# Altium schematic sheet Overview.SchDoc: Port connections / overview
size A4; SheetNumber: 1; SheetTotal: 6
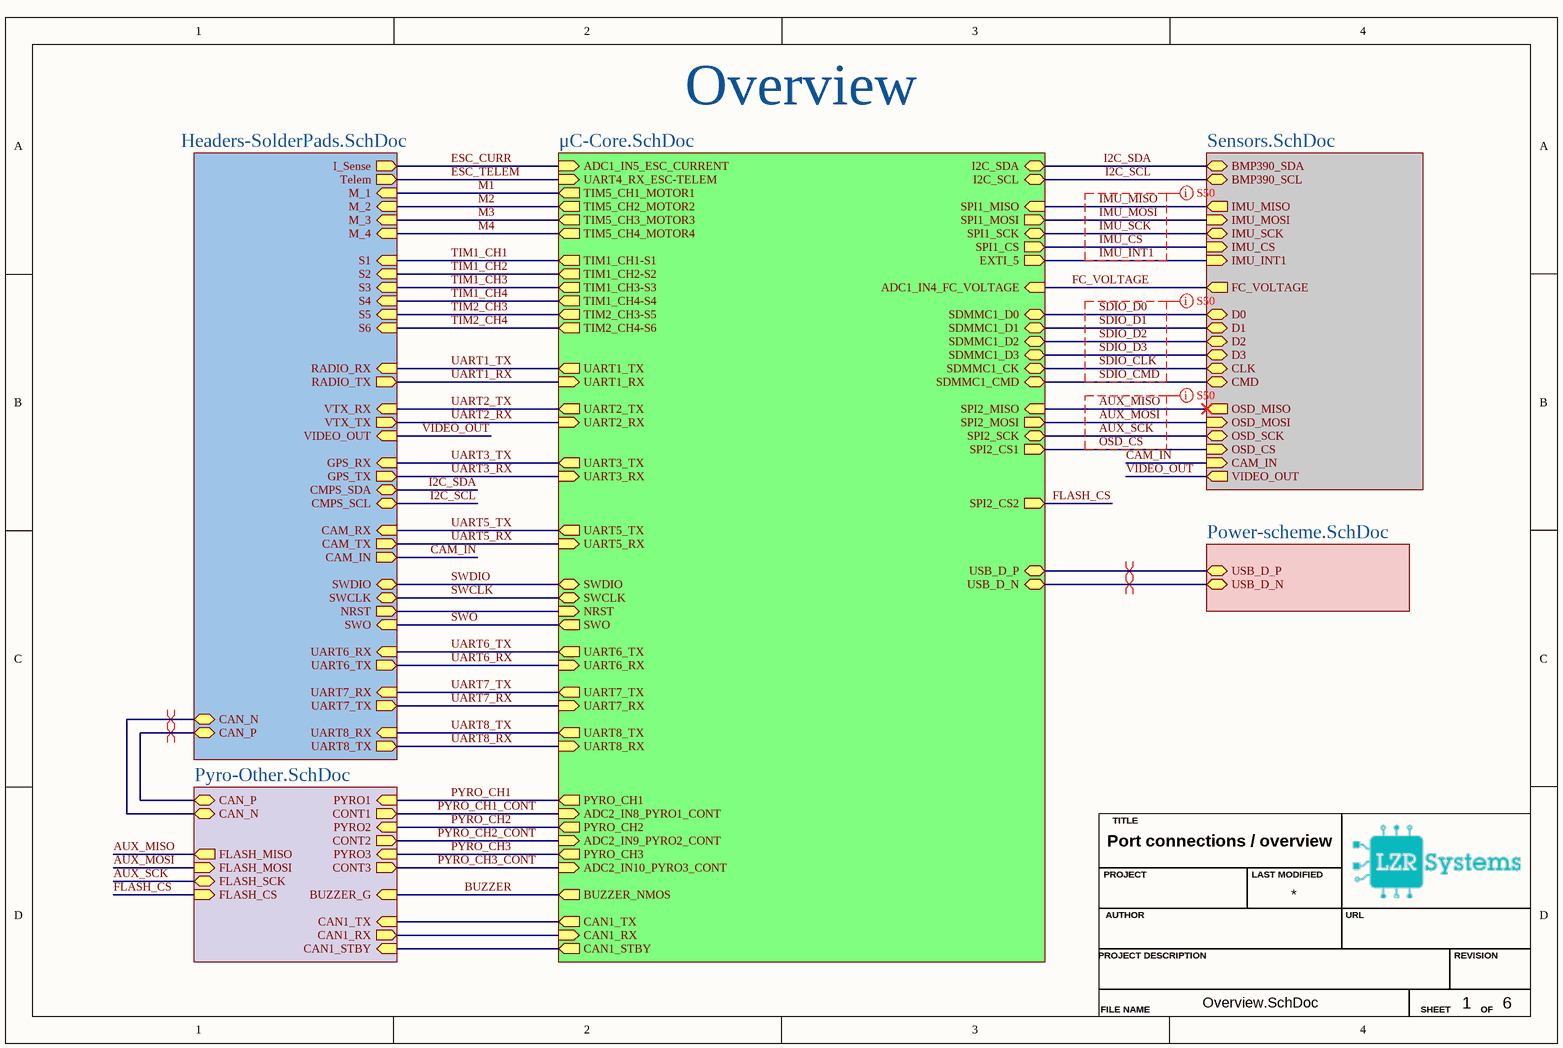
[diagram p0: Overview.SchDoc]

## Sub-sheets
U_Headers-SolderPads = Headers-SolderPads.SchDoc: I_Sense (out), M_2 (in), M_3 (in), M_4 (in), Telem (out), M_1 (in), S1 (in), S2 (in), S3 (in), S4 (in), S5 (in), S6 (in), GPS_TX (out), CMPS_SDA (bidir), CMPS_SCL (bidir), CAM_RX (in), CAM_TX (out), CAM_IN (out), SWDIO (bidir), SWCLK (bidir), SWO (in), GPS_RX (in), RADIO_TX (out), RADIO_RX (in), VTX_TX (out), VTX_RX (in), VIDEO_OUT (in), NRST (out), UART6_TX (out), UART6_RX (in), UART7_TX (out), UART7_RX (in), UART8_TX (out), UART8_RX (in), CAN_P (bidir), CAN_N (bidir)
U_Power-scheme = Power-scheme.SchDoc: USB_D_P (bidir), USB_D_N (bidir)
U_Pyro-Other = Pyro-Other.SchDoc: PYRO1 (in), CONT1 (out), PYRO2 (in), PYRO3 (in), CONT2 (out), CONT3 (out), BUZZER_G (in), CAN1_RX (out), CAN1_TX (in), CAN1_STBY (in), CAN_P (bidir), CAN_N (bidir), FLASH_MISO (out), FLASH_MOSI (in), FLASH_SCK (bidir), FLASH_CS (in)
U_Sensors = Sensors.SchDoc: BMP390_SCL (bidir), BMP390_SDA (bidir), IMU_CS (in), IMU_INT1 (in), IMU_SCK (bidir), IMU_MISO (out), IMU_MOSI (in), FC_VOLTAGE (out), D3 (bidir), D2 (bidir), CMD (bidir), CLK (bidir), D0 (bidir), D1 (bidir), OSD_CS (in), OSD_MOSI (in), OSD_MISO (out), OSD_SCK (bidir), VIDEO_OUT (out), CAM_IN (in)
U_μC-Core = μC-Core.SchDoc: SWDIO (bidir), SWCLK (bidir), SWO (out), SPI1_CS (out), SPI1_SCK (bidir), SPI1_MISO (in), SPI1_MOSI (out), SPI2_SCK (bidir), SPI2_MOSI (out), SPI2_MISO (in), SDMMC1_CMD (bidir), SDMMC1_CK (bidir), SDMMC1_D3 (bidir), SDMMC1_D2 (bidir), SDMMC1_D1 (bidir), SDMMC1_D0 (bidir), PYRO_CH3 (out), PYRO_CH2 (out), PYRO_CH1 (out), ADC1_IN4_FC_VOLTAGE (in), ADC1_IN5_ESC_CURRENT (in), TIM5_CH1_MOTOR1 (out), TIM5_CH2_MOTOR2 (out), TIM5_CH3_MOTOR3 (out), TIM5_CH4_MOTOR4 (out), UART4_RX_ESC-TELEM (in), BUZZER_NMOS (out), USB_D_P (bidir), USB_D_N (bidir), UART1_TX (out), UART1_RX (in), UART2_TX (out), UART2_RX (in), UART3_TX (out), UART3_RX (in), UART5_TX (out), UART5_RX (in), UART6_TX (out), UART6_RX (in), UART7_TX (out), UART7_RX (in), UART8_TX (out), UART8_RX (in), TIM2_CH3-S5 (out), TIM2_CH4-S6 (out), TIM1_CH1-S1 (out), TIM1_CH2-S2 (out), TIM1_CH3-S3 (out), TIM1_CH4-S4 (out), I2C_SCL (bidir), I2C_SDA (bidir), EXTI_5 (out), NRST (in), ADC2_IN8_PYRO1_CONT (in), ADC2_IN9_PYRO2_CONT (in), ADC2_IN10_PYRO3_CONT (in), CAN1_STBY (out), CAN1_RX (in), CAN1_TX (out), SPI2_CS1 (out), SPI2_CS2 (out)

## Nets
AUX_MISO: sheet U_μC-Core/SPI2_MISO, sheet U_Sensors/OSD_MISO, sheet U_Pyro-Other/FLASH_MISO
AUX_MOSI: sheet U_μC-Core/SPI2_MOSI, sheet U_Sensors/OSD_MOSI, sheet U_Pyro-Other/FLASH_MOSI
AUX_SCK: sheet U_μC-Core/SPI2_SCK, sheet U_Sensors/OSD_SCK, sheet U_Pyro-Other/FLASH_SCK
BUZZER: sheet U_μC-Core/BUZZER_NMOS, sheet U_Pyro-Other/BUZZER_G
CAM_IN: sheet U_Headers-SolderPads/CAM_IN, sheet U_Sensors/CAM_IN
ESC_CURR: sheet U_μC-Core/ADC1_IN5_ESC_CURRENT, sheet U_Headers-SolderPads/I_Sense
ESC_TELEM: sheet U_μC-Core/UART4_RX_ESC-TELEM, sheet U_Headers-SolderPads/Telem
FC_VOLTAGE: sheet U_μC-Core/ADC1_IN4_FC_VOLTAGE, sheet U_Sensors/FC_VOLTAGE
FLASH_CS: sheet U_μC-Core/SPI2_CS2, sheet U_Pyro-Other/FLASH_CS
I2C_SCL: sheet U_μC-Core/I2C_SCL, sheet U_Headers-SolderPads/CMPS_SCL, sheet U_Sensors/BMP390_SCL
I2C_SDA: sheet U_μC-Core/I2C_SDA, sheet U_Headers-SolderPads/CMPS_SDA, sheet U_Sensors/BMP390_SDA
IMU_CS: sheet U_μC-Core/SPI1_CS, sheet U_Sensors/IMU_CS
IMU_INT1: sheet U_μC-Core/EXTI_5, sheet U_Sensors/IMU_INT1
IMU_MISO: sheet U_μC-Core/SPI1_MISO, sheet U_Sensors/IMU_MISO
IMU_MOSI: sheet U_μC-Core/SPI1_MOSI, sheet U_Sensors/IMU_MOSI
IMU_SCK: sheet U_μC-Core/SPI1_SCK, sheet U_Sensors/IMU_SCK
M1: sheet U_μC-Core/TIM5_CH1_MOTOR1, sheet U_Headers-SolderPads/M_1
M2: sheet U_μC-Core/TIM5_CH2_MOTOR2, sheet U_Headers-SolderPads/M_2
M3: sheet U_μC-Core/TIM5_CH3_MOTOR3, sheet U_Headers-SolderPads/M_3
M4: sheet U_μC-Core/TIM5_CH4_MOTOR4, sheet U_Headers-SolderPads/M_4
OSD_CS: sheet U_μC-Core/SPI2_CS1, sheet U_Sensors/OSD_CS
PYRO_CH1: sheet U_μC-Core/PYRO_CH1, sheet U_Pyro-Other/PYRO1
PYRO_CH1_CONT: sheet U_μC-Core/ADC2_IN8_PYRO1_CONT, sheet U_Pyro-Other/CONT1
PYRO_CH2: sheet U_μC-Core/PYRO_CH2, sheet U_Pyro-Other/PYRO2
PYRO_CH2_CONT: sheet U_μC-Core/ADC2_IN9_PYRO2_CONT, sheet U_Pyro-Other/CONT2
PYRO_CH3: sheet U_μC-Core/PYRO_CH3, sheet U_Pyro-Other/PYRO3
PYRO_CH3_CONT: sheet U_μC-Core/ADC2_IN10_PYRO3_CONT, sheet U_Pyro-Other/CONT3
SDIO_CLK: sheet U_μC-Core/SDMMC1_CK, sheet U_Sensors/CLK
SDIO_CMD: sheet U_μC-Core/SDMMC1_CMD, sheet U_Sensors/CMD
SDIO_D0: sheet U_μC-Core/SDMMC1_D0, sheet U_Sensors/D0
SDIO_D1: sheet U_μC-Core/SDMMC1_D1, sheet U_Sensors/D1
SDIO_D2: sheet U_μC-Core/SDMMC1_D2, sheet U_Sensors/D2
SDIO_D3: sheet U_μC-Core/SDMMC1_D3, sheet U_Sensors/D3
SWCLK: sheet U_μC-Core/SWCLK, sheet U_Headers-SolderPads/SWCLK
SWDIO: sheet U_μC-Core/SWDIO, sheet U_Headers-SolderPads/SWDIO
SWO: sheet U_μC-Core/SWO, sheet U_Headers-SolderPads/SWO
TIM1_CH1: sheet U_μC-Core/TIM1_CH1-S1, sheet U_Headers-SolderPads/S1
TIM1_CH2: sheet U_μC-Core/TIM1_CH2-S2, sheet U_Headers-SolderPads/S2
TIM1_CH3: sheet U_μC-Core/TIM1_CH3-S3, sheet U_Headers-SolderPads/S3
TIM1_CH4: sheet U_μC-Core/TIM1_CH4-S4, sheet U_Headers-SolderPads/S4
TIM2_CH3: sheet U_μC-Core/TIM2_CH3-S5, sheet U_Headers-SolderPads/S5
TIM2_CH4: sheet U_μC-Core/TIM2_CH4-S6, sheet U_Headers-SolderPads/S6
UART1_RX: sheet U_μC-Core/UART1_RX, sheet U_Headers-SolderPads/RADIO_TX
UART1_TX: sheet U_μC-Core/UART1_TX, sheet U_Headers-SolderPads/RADIO_RX
UART2_RX: sheet U_μC-Core/UART2_RX, sheet U_Headers-SolderPads/VTX_TX
UART2_TX: sheet U_μC-Core/UART2_TX, sheet U_Headers-SolderPads/VTX_RX
UART3_RX: sheet U_μC-Core/UART3_RX, sheet U_Headers-SolderPads/GPS_TX
UART3_TX: sheet U_μC-Core/UART3_TX, sheet U_Headers-SolderPads/GPS_RX
UART5_RX: sheet U_μC-Core/UART5_RX, sheet U_Headers-SolderPads/CAM_TX
UART5_TX: sheet U_μC-Core/UART5_TX, sheet U_Headers-SolderPads/CAM_RX
UART6_RX: sheet U_μC-Core/UART6_RX, sheet U_Headers-SolderPads/UART6_TX
UART6_TX: sheet U_μC-Core/UART6_TX, sheet U_Headers-SolderPads/UART6_RX
UART7_RX: sheet U_μC-Core/UART7_RX, sheet U_Headers-SolderPads/UART7_TX
UART7_TX: sheet U_μC-Core/UART7_TX, sheet U_Headers-SolderPads/UART7_RX
UART8_RX: sheet U_μC-Core/UART8_RX, sheet U_Headers-SolderPads/UART8_TX
UART8_TX: sheet U_μC-Core/UART8_TX, sheet U_Headers-SolderPads/UART8_RX
VIDEO_OUT: sheet U_Headers-SolderPads/VIDEO_OUT, sheet U_Sensors/VIDEO_OUT
(unnamed): sheet U_μC-Core/USB_D_P, sheet U_Power-scheme/USB_D_P
(unnamed): sheet U_μC-Core/USB_D_N, sheet U_Power-scheme/USB_D_N
(unnamed): sheet U_μC-Core/NRST, sheet U_Headers-SolderPads/NRST
(unnamed): sheet U_μC-Core/CAN1_STBY, sheet U_Pyro-Other/CAN1_STBY
(unnamed): sheet U_μC-Core/CAN1_RX, sheet U_Pyro-Other/CAN1_RX
(unnamed): sheet U_μC-Core/CAN1_TX, sheet U_Pyro-Other/CAN1_TX
(unnamed): sheet U_Headers-SolderPads/CAN_P, sheet U_Pyro-Other/CAN_P
(unnamed): sheet U_Headers-SolderPads/CAN_N, sheet U_Pyro-Other/CAN_N

## Layout directives
differential pair: (no net found under the mark)
net class S50: AUX_MISO, AUX_MOSI, AUX_SCK, IMU_CS, IMU_INT1, IMU_MISO, IMU_MOSI, IMU_SCK, OSD_CS, SDIO_CLK, SDIO_CMD, SDIO_D0, SDIO_D1, SDIO_D2, SDIO_D3

## Notes on the sheet
- Overview
- TITLE
- AUTHOR
- PROJECT
- LAST MODIFIED
- URL
- PROJECT DESCRIPTION
- REVISION
- FILE NAME
- SHEET
- OF